# Altium schematic sheet Recovery.SchDoc
size A4; SheetNumber: 3; SheetTotal: 10
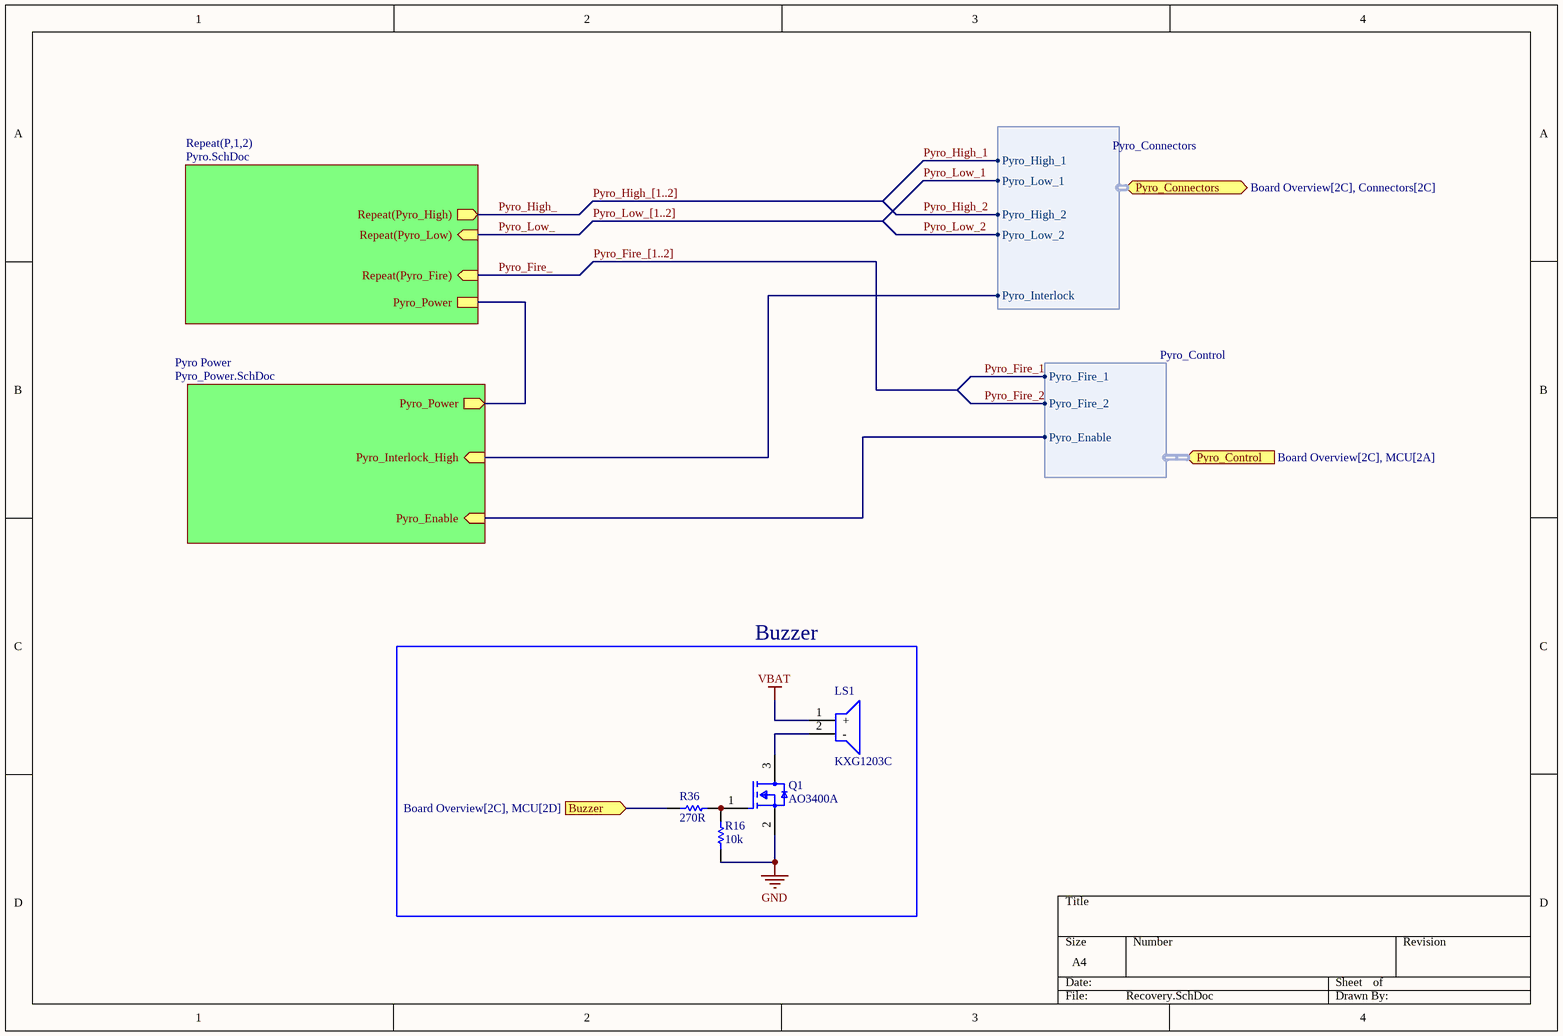
[diagram p0: Recovery.SchDoc]

## Parts
LS1  KXG1203C  [KXG1203C]
Q1  AO3400A  [FP-SOT23-IPC_C]
R16  value 10k  [RESC1609X50X30ML8T20]  (hidden comment: Generic-Resistor)
R36  value 270R  [RESC1609X50X30ML8T20]  (hidden comment: Generic-Resistor)

## Blocks framed on the sheet
Buzzer: LS1 Q1 R16 R36

## Sub-sheets
Pyro Power = Pyro_Power.SchDoc: Pyro_Interlock_High (in), Pyro_Enable (in), Pyro_Power (out)
Repeat(P,1,2) = Pyro.SchDoc: Repeat(Pyro_Fire) (in), Repeat(Pyro_High) (out), Repeat(Pyro_Low) (in), Pyro_Power

## Ports
Buzzer (in, see Board Overview[2C], MCU[2D]), Pyro_Connectors (bidir, harness Pyro_Connectors, see Board Overview[2C], Connectors[2C]), Pyro_Control (in, harness Pyro_Control, see Board Overview[2C], MCU[2A])

## Harnesses
Pyro_Control: Pyro_Fire_1, Pyro_Enable, Pyro_Fire_2
Pyro_Connectors: Pyro_High_1, Pyro_Low_1, Pyro_Interlock, Pyro_High_2, Pyro_Low_2

## Nets
GND: Q1.2(S) R16.1
VBAT: LS1.1(+)
Buzzer: R36.1 ; port Buzzer
Pyro_Fire_: sheet Repeat(P,1,2)/Repeat(Pyro_Fire)
Pyro_Fire_1: port Pyro_Control.Pyro_Fire_1
Pyro_Fire_2: port Pyro_Control.Pyro_Fire_2
Pyro_High_: sheet Repeat(P,1,2)/Repeat(Pyro_High)
Pyro_High_1: port Pyro_Connectors.Pyro_High_1
Pyro_High_2: port Pyro_Connectors.Pyro_High_2
Pyro_Low_: sheet Repeat(P,1,2)/Repeat(Pyro_Low)
Pyro_Low_1: port Pyro_Connectors.Pyro_Low_1
Pyro_Low_2: port Pyro_Connectors.Pyro_Low_2
NetLS1_2: LS1.2(-) Q1.3(D)
NetQ1_1: Q1.1(G) R16.2 R36.2
(unnamed): sheet Repeat(P,1,2)/Pyro_Power, sheet Pyro Power/Pyro_Power
(unnamed): sheet Pyro Power/Pyro_Interlock_High, port Pyro_Connectors.Pyro_Interlock
(unnamed): sheet Pyro Power/Pyro_Enable, port Pyro_Control.Pyro_Enable

## Buses and harness runs
bus Pyro_Fire_[1..2]
bus Pyro_High_[1..2]
bus Pyro_Low_[1..2]

## Library data of the parts
LS1 = CMP-059-000000-1: Kingstate 5V dc PCB Mount Electromagnetic Buzzer; Source: SamacSys.SchLib; Design Item ID: KXG1203C; Manufacturer_Part_Number: KXG1203C; Datasheet Link: http://uk.rs-online.com/web/p/products/7716957P; RS Price/Stock: http://uk.rs-online.com/web/p/products/7716957P; Height: 9.5mm; Manufacturer_Name: KINGSTATE; RS Part Number: 7716957P
Q1 = CMP-013-00038-1: N沟道 VDS=30V VGS=±12V ID=5.7A P=1.4W; LCSC Part #: C20917
R16 R36 = CMP-009-00185-4: Generic 0603 Resistor; Power Rating: 100mW; Tolerance: 0%; Voltage Rating: 75V; Case Code (Metric): 1608; Case Code (Imperial): 0603
  R16: LCSC Part #: C25804
  R36: LCSC Part #: C22966